# Altium schematic sheet FirstStageAmplifier.SchDoc
size A4; CarNumber: 5; Author: Michał Kowalik; CompanyName: AGH; Engineer: dr inż. Piotr Otfinowski; DocumentNumber: 6; Revision: Rev; SheetNumber: 6; SheetTotal: 6; ProjectName: Project Name
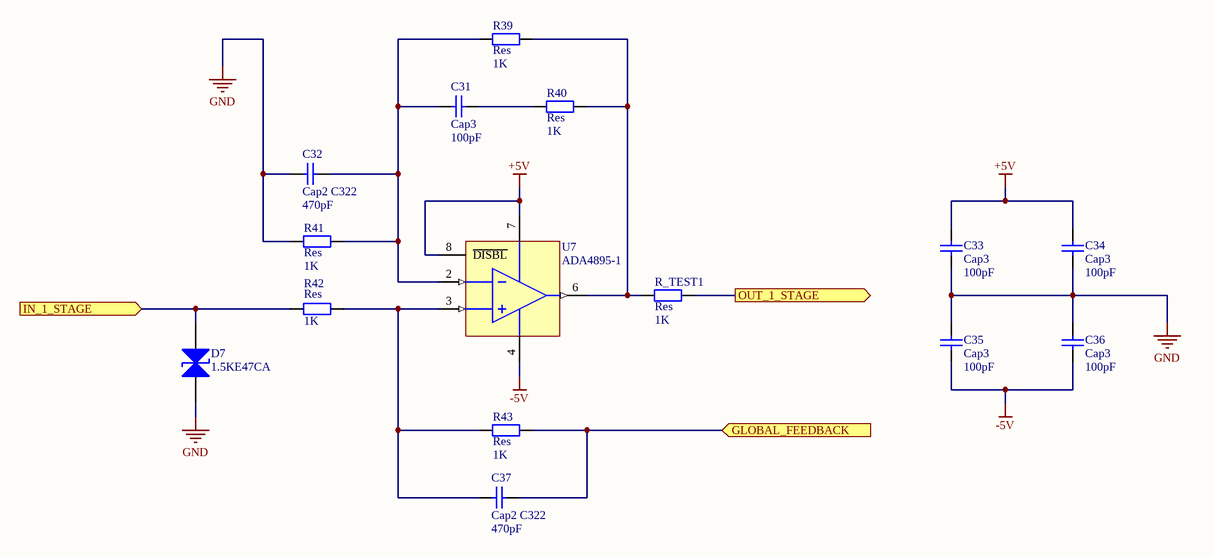
[diagram p0: FirstStageAmplifier.SchDoc]

## Parts
C31  Cap3  value 100pF  [CAP_0805_IPC_MD]
C32  Cap2 C322  value 470pF  [CAP-CERAMIC-200MIL]
C33  Cap3  value 100pF  [CAP_0805_IPC_MD]
C34  Cap3  value 100pF  [CAP_0805_IPC_MD]
C35  Cap3  value 100pF  [CAP_0805_IPC_MD]
C36  Cap3  value 100pF  [CAP_0805_IPC_MD]
C37  Cap2 C322  value 470pF  [CAP-CERAMIC-200MIL]
D7  1.5KE47CA  [DIODE-0.7]
R39  Res  value 1K  [RESISTOR-10mm]
R40  Res  value 1K  [RESISTOR-10mm]
R41  Res  value 1K  [RESISTOR-10mm]
R42  Res  value 1K  [RESISTOR-10mm]
R43  Res  value 1K  [RESISTOR-10mm]
R_TEST1  Res  value 1K  [RESISTOR-10mm]
U7  ADA4895-1  [SOIC_8_IPC_MD]

## Ports
GLOBAL_FEEDBACK (in), IN_1_STAGE (in), OUT_1_STAGE (out)

## Nets
+5V: C33.2 C34.2 U7.7(VDD) U7.8(~{DISBL})
-5V: C35.1 C36.1 U7.4(VSS)
GND: C32.1 C33.1 C34.1 C35.2 C36.2 D7.1(IN1) R41.1
GLOBAL_FEEDBACK: C37.2 R43.2 ; port GLOBAL_FEEDBACK
IN_1_STAGE: D7.2(IN2) R42.1 ; port IN_1_STAGE
OUT_1_STAGE: R_TEST1.2 ; port OUT_1_STAGE
NetC31_1: C31.1 C32.2 R39.1 R41.2 U7.2(VIND-)
NetC31_2: C31.2 R40.1
NetC37_1: C37.1 R42.2 R43.1 U7.3(VIND+)
NetR39_2: R39.2 R40.2 R_TEST1.1 U7.6(VOUTD)

## Notes on the sheet
- Document name:
- Project name:
- Author:
- Date/Time:
- Sheet:
- Revision:
- of
- Designer:

## Library data of the parts
C31 C33-C36 = Cap3: Standard SMD 0805 Capacitor
C32 C37 = Cap2: KEMEX Radial Leaded Multilayer Ceramic Capacitors / Goldmax, 300 Series, Conformally Coated, / C0G Dielectric, 25 – 250 VDC (Commercial Grade)
D7 = 1.5KE47CA: Transient Voltage Suppressor Diodes; Breakdown V: 44.7...49.4, Stand-off V: 40.2
R39-R43 R_TEST1 = Res: Resistor
U7 = ADA4895-1: Low Power, 1 nV/√Hz, G ≥ 10 Stable, Rail-to-Rail Output Amplifier